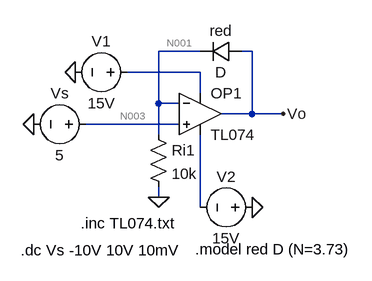
[diagram p0: schematic 4_3_1_d.asc]
4_3_1_d.asc, the LTspice schematic file:
Version 4
SHEET 1 880 680
WIRE 192 16 128 16
WIRE 272 16 256 16
WIRE 192 48 80 48
WIRE 192 80 192 48
WIRE 128 96 128 16
WIRE 160 96 128 96
WIRE 272 112 272 16
WIRE 272 112 224 112
WIRE 320 112 272 112
WIRE 160 128 16 128
WIRE 128 144 128 96
WIRE 128 240 128 224
WIRE 192 256 192 144
FLAG 128 240 0
FLAG 272 256 0
FLAG 0 48 0
FLAG -64 128 0
FLAG 320 112 Vo
SYMBOL res 112 128 R0
SYMATTR InstName Ri1
SYMATTR Value 10k
SYMBOL voltage 96 48 R90
WINDOW 0 -32 56 VBottom 2
WINDOW 3 32 56 VTop 2
SYMATTR InstName V1
SYMATTR Value 15V
SYMBOL voltage 288 256 R90
WINDOW 0 -32 56 VBottom 2
WINDOW 3 32 56 VTop 2
SYMATTR InstName V2
SYMATTR Value 15V
SYMBOL Opamps\\opamp2 192 48 R0
SYMATTR InstName OP1
SYMATTR Value TL074
SYMBOL voltage 32 128 R90
WINDOW 0 -32 56 VBottom 2
WINDOW 3 32 56 VTop 2
WINDOW 123 0 0 Left 0
WINDOW 39 0 0 Left 0
SYMATTR InstName Vs
SYMATTR Value 5
SYMBOL diode 256 0 R90
WINDOW 0 0 32 VBottom 2
WINDOW 3 32 32 VTop 2
SYMATTR InstName red
TEXT 8 280 Left 2 !.inc TL074.txt
TEXT -84 322 Left 2 !.dc Vs -10V 10V 10mV
TEXT 184 320 Left 2 !.model red D (N=3.73)

The netlist it stands for:
* 4_3_1_d.asc
Ri1 N001 0 10k
V1 N002 0 15V
V2 0 N004 15V
XOP1 N003 N001 N002 N004 Vo TL074  ; pins In+ In- V+ V- OUT
Vs N003 0 5
D§red Vo N001 D
.model D D
.lib standard.dio
.inc TL074.txt
.dc Vs -10V 10V 10mV
.model red D (N=3.73)
.backanno
.end

* Results of the author's LTspice run, read from the files saved beside the schematic
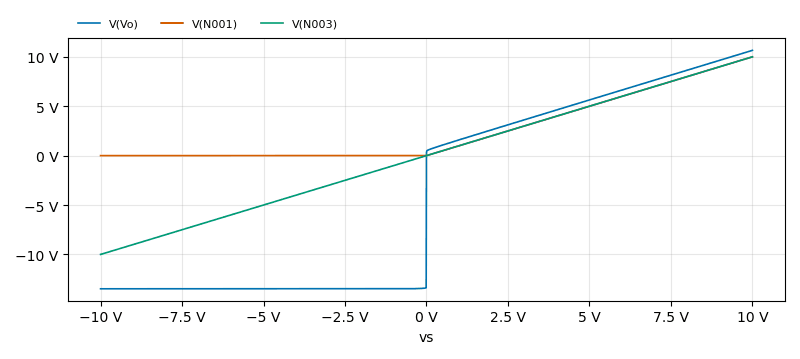
[diagram p1: DC transfer characteristic of 4_3_1_d.asc, plotted from the saved traces]
* DC transfer characteristic, 1 run:
*   V(Vo): -13.48 V at vs=-10 V, 10.65 V at vs=10 V, min -13.48 V, max 10.65 V
*   V(N001): -686.2 nV at vs=-10 V, 10 V at vs=10 V, min -686.2 nV, max 10 V
*   V(N003): -10 V at vs=-10 V, 10 V at vs=10 V, min -10 V, max 10 V